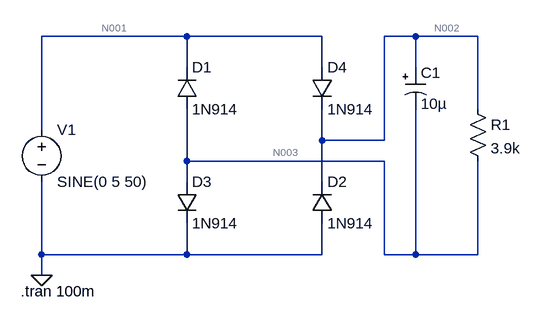
[diagram p0: schematic Lab2_second.asc]
Lab2_second.asc, the LTspice schematic file:
Version 4
SHEET 1 880 680
WIRE -128 64 -352 64
WIRE 80 64 -128 64
WIRE 224 64 176 64
WIRE 320 64 224 64
WIRE -128 112 -128 64
WIRE 80 112 80 64
WIRE 224 112 224 64
WIRE 320 176 320 64
WIRE -352 208 -352 64
WIRE 80 224 80 176
WIRE 176 224 176 64
WIRE 176 224 80 224
WIRE -128 256 -128 176
WIRE 176 256 -128 256
WIRE -128 288 -128 256
WIRE 80 288 80 224
WIRE -352 400 -352 288
WIRE -128 400 -128 352
WIRE -128 400 -352 400
WIRE 80 400 80 352
WIRE 80 400 -128 400
WIRE 176 400 176 256
WIRE 224 400 224 176
WIRE 224 400 176 400
WIRE 320 400 320 256
WIRE 320 400 224 400
WIRE -352 432 -352 400
FLAG -352 432 0
SYMBOL voltage -352 192 R0
WINDOW 123 0 0 Left 2
WINDOW 39 0 0 Left 2
SYMATTR InstName V1
SYMATTR Value SINE(0 5 50)
SYMBOL res 304 160 R0
SYMATTR InstName R1
SYMATTR Value 3.9k
SYMBOL polcap 208 112 R0
WINDOW 3 24 56 Left 2
SYMATTR Value 10µ
SYMATTR InstName C1
SYMATTR Description Capacitor
SYMATTR Type cap
SYMATTR SpiceLine V=6.3 Irms=2.21565 Rser=0.055 Lser=0 mfg="KEMET" pn="A700V106M006ATE055" type="Al electrolytic"
SYMBOL diode -144 176 M180
WINDOW 0 24 64 Left 2
WINDOW 3 24 0 Left 2
SYMATTR InstName D1
SYMATTR Value 1N914
SYMBOL diode 64 352 M180
WINDOW 0 24 64 Left 2
WINDOW 3 24 0 Left 2
SYMATTR InstName D2
SYMATTR Value 1N914
SYMBOL diode -144 288 R0
SYMATTR InstName D3
SYMATTR Value 1N914
SYMBOL diode 64 112 R0
SYMATTR InstName D4
SYMATTR Value 1N914
TEXT -384 456 Left 2 !.tran 100m

The netlist it stands for:
* Lab2_second.asc
V1 N001 0 SINE(0 5 50)
R1 N002 N003 3.9k
C1 N002 N003 10µ V=6.3 Irms=2.21565 Rser=0.055 Lser=0 mfg="KEMET" pn="A700V106M006ATE055" type="Al electrolytic"
D1 N003 N001 1N914
D2 0 N002 1N914
D3 N003 0 1N914
D4 N001 N002 1N914
.model D D
.lib standard.dio
.tran 100m
.backanno
.end

* Results of the author's LTspice run, read from the files saved beside the schematic
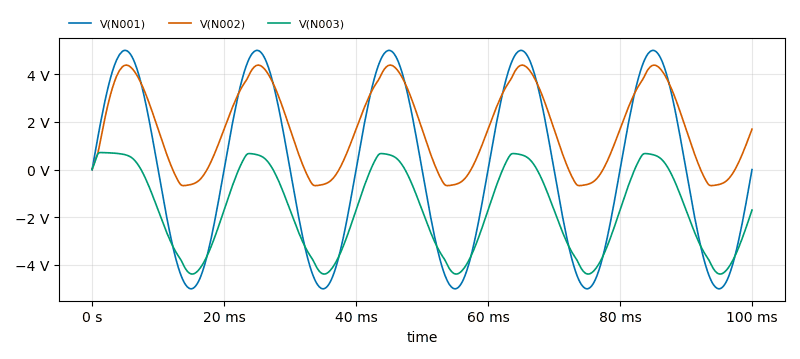
[diagram p1: Transient Analysis of Lab2_second.asc, plotted from the saved traces]
* Transient Analysis, 1 run:
*   V(N001): min -4.999 V, max 4.999 V, average -145.7 µV, rms 3.538 V, last 0 V
*   V(N002): min -672.5 mV, max 4.38 V, average 1.699 V, rms 2.453 V, last 1.696 V
*   V(N003): min -4.38 V, max 713.9 mV, average -1.699 V, rms 2.478 V, last -1.696 V